# EasyEDA Pro project Charger Splitter.eprj, board PCB1
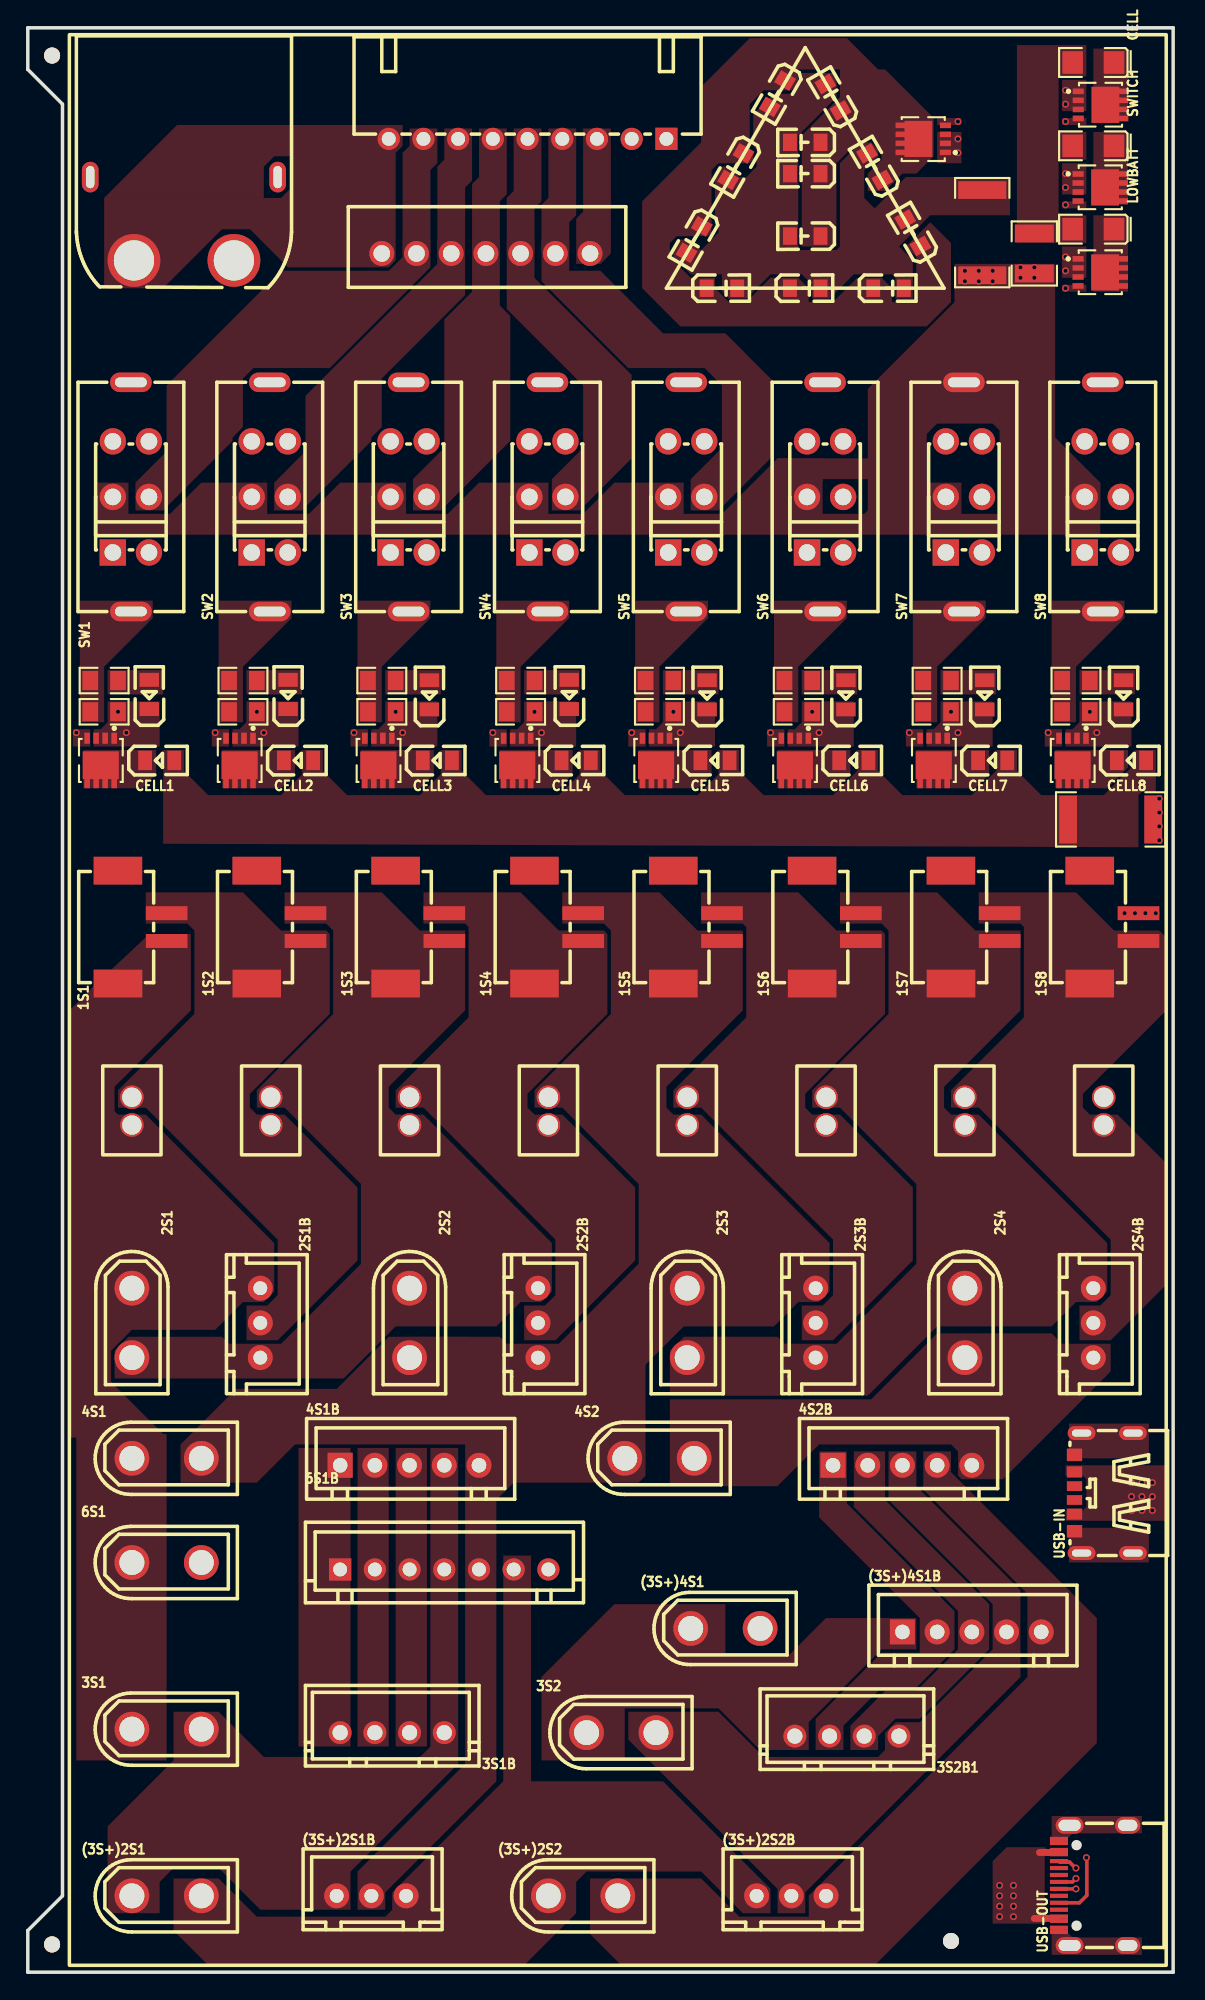
[diagram p5: board, top side]
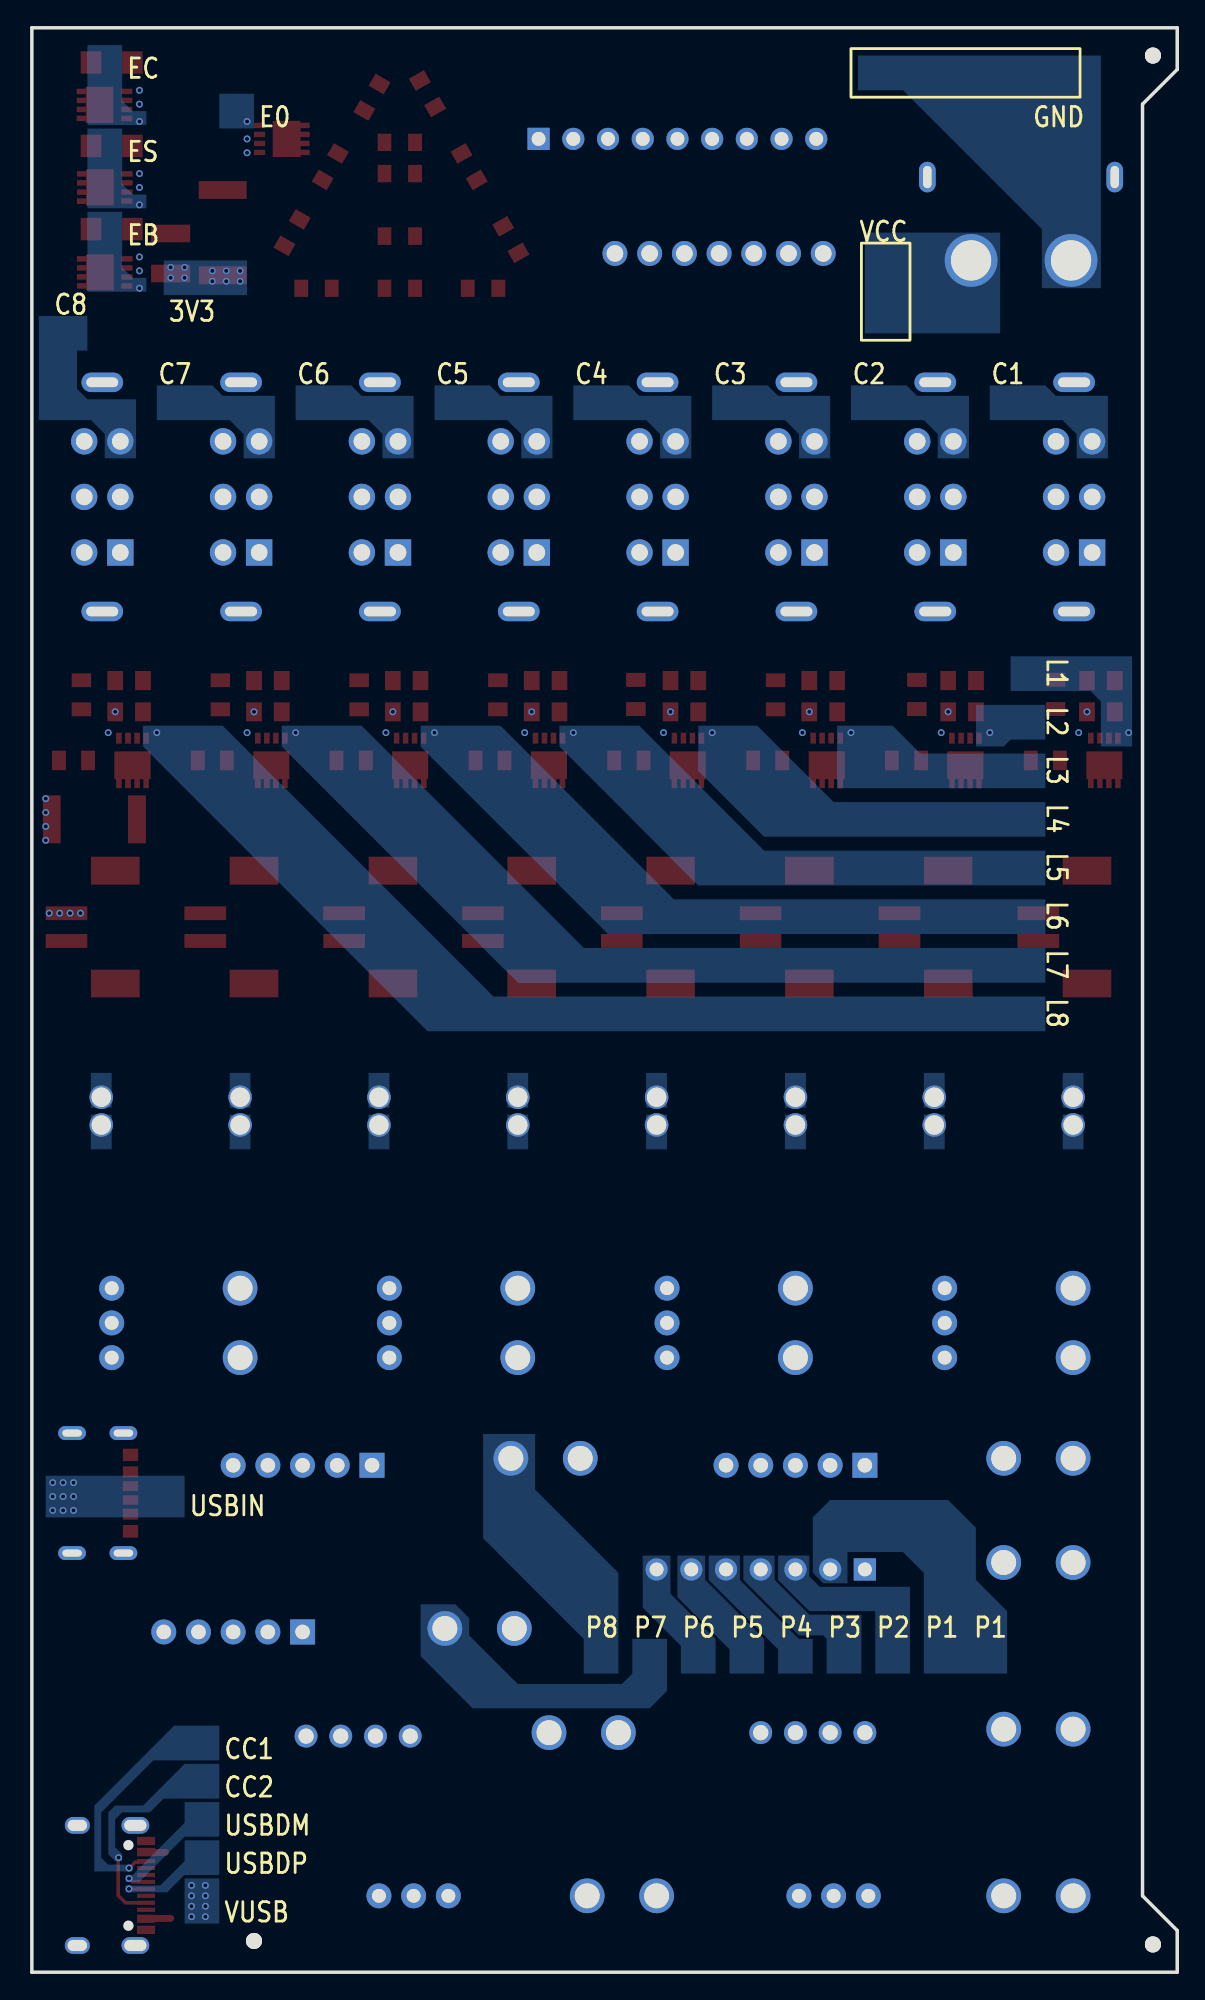
[diagram p6: board, bottom side, seen from below]

Outline 82.5 x 140 mm; copper layers: Top Layer, Inner1, Inner2, Inner3, Inner4, Bottom Layer. Coordinates in mm from the lower left corner of the outline.
Outline path: 0,140 82.5,140 82.5,0 0,0 0,3 2.5,5.5 2.5,134.5 0,137 0,140
Stack: Top Layer 0.035mm Outer layer thickness 1oz / Dielectric1 0.0994mm 3313 RC57% 4.2mil / Inner1 0.0152mm Inner layer thickness / Dielectric2 0.55mm 0.55mm H/H No copper / Inner2 0.0152mm Inner layer thickness / Dielectric3 0.1088mm 2116 RC54% 4.9mil / Inner3 0.0152mm Inner layer thickness / Dielectric4 0.55mm 0.55mm H/H No copper / Inner4 0.0152mm Inner layer thickness / Dielectric5 0.0994mm 3313 RC57% 4.2mil / Bottom Layer 0.035mm Outer layer thickness 1oz

## Design rules (mm)
template: JLCPCB Capability(Two Layers Board)
spacing copperThickness1oz (default): track to track 0.102, other pairs 0.152 to 0.3
spacing copperThickness2oz: track to track 0.203, other pairs 0.152 to 0.3
track width copperThickness1oz (default): min 0.127, default 0.254, max 2.54
track width copperThickness2oz: min 0.203, default 0.254, max 2.54
differential pair differentialPair (default): width min 0.127, default 0.254, max 2.54; gap min 0.152, default 0.152
via viaSize (default): diameter min 0.5, default 0.61, max 10; hole min 0.3, default 0.305, max 6.3

## Placement (name value [footprint] x y rotation side)
1S1  PH2.0-2P-LT  [CONN-SMD_PH2.0-1X2PW]  8.25 75.25 90 top
1S2  PH2.0-2P-LT  [CONN-SMD_PH2.0-1X2PW]  18.25 75.25 90 top
1S3  PH2.0-2P-LT  [CONN-SMD_PH2.0-1X2PW]  28.25 75.25 90 top
1S4  PH2.0-2P-LT  [CONN-SMD_PH2.0-1X2PW]  38.25 75.25 90 top
1S5  PH2.0-2P-LT  [CONN-SMD_PH2.0-1X2PW]  48.25 75.25 90 top
1S6  PH2.0-2P-LT  [CONN-SMD_PH2.0-1X2PW]  58.25 75.25 90 top
1S7  PH2.0-2P-LT  [CONN-SMD_PH2.0-1X2PW]  68.25 75.25 90 top
1S8  PH2.0-2P-LT  [CONN-SMD_PH2.0-1X2PW]  78.25 75.25 90 top
2S1  XT30UPB-M  [CONN-TH_XT30UPB-M]  7.5 46.75 270 top
2S1B  XH-3A  [CONN-TH_XH-3A]  16.75 46.75 270 top
2S2  XT30UPB-M  [CONN-TH_XT30UPB-M]  27.5 46.75 270 top
2S2B  XH-3A  [CONN-TH_XH-3A]  36.75 46.75 270 top
2S3  XT30UPB-M  [CONN-TH_XT30UPB-M]  47.5 46.75 270 top
2S3B  XH-3A  [CONN-TH_XH-3A]  56.75 46.75 270 top
2S4  XT30UPB-M  [CONN-TH_XT30UPB-M]  67.5 46.75 270 top
2S4B  XH-3A  [CONN-TH_XH-3A]  76.75 46.75 270 top
3S1  XT30UPB-M  [CONN-TH_XT30UPB-M]  10 17.5 0 top
3S1B  XH-4A  [CONN-TH_XH2.50-4P]  26.25 17.25 180 top
3S2  XT30UPB-M  [CONN-TH_XT30UPB-M]  42.75 17.25 0 top
3S2B1  XH-4A  [CONN-TH_XH2.50-4P]  59 17 180 top
4S1  XT30UPB-M  [CONN-TH_XT30UPB-M]  10 37 0 top
4S1B  XH-5A  [CONN-TH_5P-P2.50_XH-5A]  27.5 36.5 0 top
4S2  XT30UPB-M  [CONN-TH_XT30UPB-M]  45.5 37 0 top
4S2B  XH-5A  [CONN-TH_5P-P2.50_XH-5A]  63 36.5 0 top
6S1  XT30UPB-M  [CONN-TH_XT30UPB-M]  10 29.5 0 top
6S1B  XH-7A  [CONN-TH_7P-P2.50_HCTL_XH-7A]  30 29 0 top
(3S+)2S1  XT30UPB-M  [CONN-TH_XT30UPB-M]  10 5.5 0 top
(3S+)2S1B  XH-3A  [CONN-TH_XH-3A]  24.75 5.5 0 top
(3S+)2S2  XT30UPB-M  [CONN-TH_XT30UPB-M]  40 5.5 0 top
(3S+)2S2B  XH-3A  [CONN-TH_XH-3A]  55 5.5 0 top
(3S+)4S1  XT30UPB-M  [CONN-TH_XT30UPB-M]  50.25 24.75 0 top
(3S+)4S1B  XH-5A  [CONN-TH_5P-P2.50_XH-5A]  68 24.5 0 top
CELL  KT-1206W  [LED1206-R-RD_WHITE]  76.75 137.5 180 top
CELL1  NCD0805R1  [LED0805-R-RD]  9.5 87.25 0 top
CELL2  NCD0805R1  [LED0805-R-RD]  19.5 87.25 0 top
CELL3  NCD0805R1  [LED0805-R-RD]  29.5 87.25 0 top
CELL4  NCD0805R1  [LED0805-R-RD]  39.5 87.25 0 top
CELL5  NCD0805R1  [LED0805-R-RD]  49.5 87.25 0 top
CELL6  NCD0805R1  [LED0805-R-RD]  59.5 87.25 0 top
CELL7  NCD0805R1  [LED0805-R-RD]  69.5 87.25 0 top
CELL8  NCD0805R1  [LED0805-R-RD]  79.5 87.25 0 top
CELLLEDQ1  AGM6014AP  [PDFN-8_L3.1-W3.0-P0.65-LS3.3-BL]  5.25 87.25 180 top
CELLLEDQ2  AGM6014AP  [PDFN-8_L3.1-W3.0-P0.65-LS3.3-BL]  15.25 87.25 180 top
CELLLEDQ3  AGM6014AP  [PDFN-8_L3.1-W3.0-P0.65-LS3.3-BL]  25.25 87.25 180 top
CELLLEDQ4  AGM6014AP  [PDFN-8_L3.1-W3.0-P0.65-LS3.3-BL]  35.25 87.25 180 top
CELLLEDQ5  AGM6014AP  [PDFN-8_L3.1-W3.0-P0.65-LS3.3-BL]  45.25 87.25 180 top
CELLLEDQ6  AGM6014AP  [PDFN-8_L3.1-W3.0-P0.65-LS3.3-BL]  55.25 87.25 180 top
CELLLEDQ7  AGM6014AP  [PDFN-8_L3.1-W3.0-P0.65-LS3.3-BL]  65.25 87.25 180 top
CELLLEDQ8  AGM6014AP  [PDFN-8_L3.1-W3.0-P0.65-LS3.3-BL]  75.25 87.25 180 top
CELLLEDR1  68Ω  [R2512]  78 83 0 top
CN9  XH-9AW  [CONN-TH_9P-P2.50_XH-9AW]  36 132 180 top
CN10  XT60PW-M  [CONN-TH_XT60PW-M]  11.25 126.25 270 top
ERRORLEDARR1  XL-2012UPC  [LED0805-RD_PINK]  54 135.25 240 top
ERRORLEDARR2  XL-2012UPC  [LED0805-RD_PINK]  61 130 120 top
ERRORLEDARR3  XL-2012UPC  [LED0805-RD_PINK]  63.75 125.25 120 top
ERRORLEDARR4  XL-2012UPC  [LED0805-RD_PINK]  50 121.25 0 top
ERRORLEDARR5  XL-2012UPC  [LED0805-RD_PINK]  51 130 240 top
ERRORLEDARR6  XL-2012UPC  [LED0805-RD_PINK]  48 124.75 240 top
ERRORLEDARR7  XL-2012UPC  [LED0805-RD_PINK]  58 135 120 top
ERRORLEDARR8  XL-2012UPC  [LED0805-RD_PINK]  62 121.25 0 top
ERRORLEDARR9  XL-2012UPC  [LED0805-RD_PINK]  56 125 180 top
ERRORLEDARR10  XL-2012UPC  [LED0805-RD_PINK]  56 131.75 180 top
ERRORLEDARR11  XL-2012UPC  [LED0805-RD_PINK]  56 129.5 180 top
ERRORLEDARR12  XL-2012UPC  [LED0805-RD_PINK]  56 121.25 0 top
ERRORLEDARRQ1  AGM6014AP  [PDFN-8_L3.1-W3.0-P0.65-LS3.3-BL]  64.5 132 90 top
ERRORLEDARRR1  30Ω  [R2512]  68.75 125.25 90 top
ERRORLEDQ1  AGM6014AP  [PDFN-8_L3.1-W3.0-P0.65-LS3.3-BL]  77.27 134.45 270 top
ERRORLEDQ2  AGM6014AP  [PDFN-8_L3.1-W3.0-P0.65-LS3.3-BL]  77.25 128.5 270 top
ERRORLEDQ3  AGM6014AP  [PDFN-8_L3.1-W3.0-P0.65-LS3.3-BL]  77.25 122.38 270 top
ERRORLEDR3  20Ω  [R1210]  72.5 123.75 90 top
LOWBATT  KT-1206W  [LED1206-R-RD_WHITE]  76.75 125.5 180 top
NOREF  -  [Pad_e17]  37.5 61 0 top
NOREF#2  -  [Pad_e28]  77.5 63 0 top
NOREF#3  -  [Pad_e13]  27.5 63 0 top
NOREF#4  -  [Pad_e20]  47.5 61 0 top
NOREF#5  -  [Pad_e324]  1.75 138 0 top
NOREF#6  -  [Pad_e14]  27.5 61 0 top
NOREF#7  -  [Pad_e26]  67.5 61 0 top
NOREF#8  -  [Pad_e19]  47.5 63 0 top
NOREF#9  -  [Pad_e7]  7.5 61 0 top
NOREF#10  -  [Pad_e11]  17.5 61 0 top
NOREF#11  -  [Pad_e222]  66.5 2.25 0 top
NOREF#12  -  [Pad_e22]  57.5 63 0 top
NOREF#13  -  [Pad_e2]  7.5 63 0 top
NOREF#14  -  [Pad_e23]  57.5 61 0 top
NOREF#15  -  [Pad_e25]  67.5 63 0 top
NOREF#16  -  [Pad_e16]  37.5 63 0 top
NOREF#17  -  [Pad_e10]  17.5 63 0 top
NOREF#18  -  [Pad_e29]  77.5 61 0 top
NOREF#19  -  [Pad_e287]  1.75 2 0 top
P2  XH-7A  [CONN-TH_7P_XH-7A]  33 123.75 0 top
SW1  SS-22F07-G100  [SW-TH_6P-L16.5-W7.5-P4.0-LS2.6-TL]  7.43 106.22 90 top
SW1LED1  NCD0805Y1  [LED0805-R-RD]  8.75 92 90 top
SW1R1  3kΩ  [R0805]  5.5 90.75 0 top
SW1R2  68Ω  [R0805]  5.5 93 0 top
SW2  SS-22F07-G100  [SW-TH_6P-L16.5-W7.5-P4.0-LS2.6-TL]  17.43 106.22 90 top
SW2LED1  NCD0805Y1  [LED0805-R-RD]  18.75 92 90 top
SW2R1  3kΩ  [R0805]  15.5 90.75 0 top
SW2R2  68Ω  [R0805]  15.5 93 0 top
SW3  SS-22F07-G100  [SW-TH_6P-L16.5-W7.5-P4.0-LS2.6-TL]  27.43 106.22 90 top
SW3LED1  NCD0805Y1  [LED0805-R-RD]  28.93 91.97 90 top
SW3R1  3kΩ  [R0805]  25.5 90.75 0 top
SW3R2  68Ω  [R0805]  25.5 93 0 top
SW4  SS-22F07-G100  [SW-TH_6P-L16.5-W7.5-P4.0-LS2.6-TL]  37.43 106.22 90 top
SW4LED1  NCD0805Y1  [LED0805-R-RD]  39 92 90 top
SW4R1  3kΩ  [R0805]  35.5 90.75 0 top
SW4R2  68Ω  [R0805]  35.5 93 0 top
SW5  SS-22F07-G100  [SW-TH_6P-L16.5-W7.5-P4.0-LS2.6-TL]  47.43 106.22 90 top
SW5LED1  NCD0805Y1  [LED0805-R-RD]  48.93 91.97 90 top
SW5R1  3kΩ  [R0805]  45.5 90.75 0 top
SW5R2  68Ω  [R0805]  45.5 93 0 top
SW6  SS-22F07-G100  [SW-TH_6P-L16.5-W7.5-P4.0-LS2.6-TL]  57.43 106.22 90 top
SW6LED1  NCD0805Y1  [LED0805-R-RD]  58.93 91.97 90 top
SW6R1  3kΩ  [R0805]  55.5 90.75 0 top
SW6R2  68Ω  [R0805]  55.5 93 0 top
SW7  SS-22F07-G100  [SW-TH_6P-L16.5-W7.5-P4.0-LS2.6-TL]  67.43 106.22 90 top
SW7LED1  NCD0805Y1  [LED0805-R-RD]  68.93 91.97 90 top
SW7R1  3kΩ  [R0805]  65.5 90.75 0 top
SW7R2  68Ω  [R0805]  65.5 93 0 top
SW8  SS-22F07-G100  [SW-TH_6P-L16.5-W7.5-P4.0-LS2.6-TL]  77.43 106.22 90 top
SW8LED1  NCD0805Y1  [LED0805-R-RD]  78.93 91.97 90 top
SW8R1  3kΩ  [R0805]  75.5 90.75 0 top
SW8R2  68Ω  [R0805]  75.5 93 0 top
SWITCH  KT-1206W  [LED1206-R-RD_WHITE]  76.75 131.5 180 top
USB-IN  KH-TYPE-C-6P  [TYPE-C-SMD_TYPE-C-31-M-16]  77.5 34.5 90 top
USB-OUT  TYPE-C-31-M-12  [USB-C_SMD-TYPE-C-31-M-12]  76.75 6.25 90 top

## Footprints (pads in the part's own frame, mm; a bottom-side part is the same pattern mirrored in y, then rotated)
CONN-SMD_PH2.0-1X2PW
  rect 1x3 smd: 1(-1,-1.756) 2(1,-1.756)
  rect 2x3.5 smd: 3(4.064,1.756) 4(-4.064,1.756)
CONN-TH_5P-P2.50_XH-5A
  rect 1.8x1.8 hole 1.05: 1(-5,0)
  round 1.8 hole 1.05: 2(-2.498,0) 3(0.002,0) 4(2.501,0) 5(5,0)
CONN-TH_7P-P2.50_HCTL_XH-7A
  rect 1.6x1.6 hole 1: 1(-7.5,0)
  round 1.6 hole 1: 2(-5,0) 3(-2.5,0) 4(0,0) 5(2.5,0) 6(5,0) 7(7.5,0)
CONN-TH_7P_XH-7A
  round 1.8 hole 1.199: 1(-7.5,0) 2(-4.998,0) 3(-2.499,0) 4(0,0) 5(2.499,0) 6(5.002,0) 7(7.5,0)
CONN-TH_9P-P2.50_XH-9AW
  rect 1.6x1.6 hole 1: 1(-10,0)
  round 1.6 hole 1: 2(-7.5,0) 3(-5,0) 4(-2.5,0) 5(0,0) 6(2.5,0) 7(5,0) 8(7.5,0) 9(10,0)
CONN-TH_XH2.50-4P
  round 1.65 hole 1.1: 1(-3.75,0) 2(-1.25,0) 3(1.25,0) 4(3.75,0)
CONN-TH_XH-3A
  round 1.8 hole 1: 1(-2.5,0) 2(0,0) 3(2.5,0)
CONN-TH_XT30UPB-M
  round 2.5 hole 1.8: 1(-2.5,0) 2(2.5,0)
CONN-TH_XT60PW-M
  round 3.8 hole 2.9: 1(3,-3.6) 2(3,3.6)
  oval 2.2x1.2 hole 1.6x0.6: 3(-3,6.75) 4(-3,-6.75)
LED0805-R-RD
  rect 1x1.399 smd: 1(1.05,0) 2(-1.05,0)
LED0805-RD_PINK
  rect 1x1.25 smd: 1(-1.1,0) 2(1.1,0)
LED1206-R-RD_WHITE
  rect 1.485x1.62 smd: 1(1.492,0) 2(-1.492,0)
Pad_e2
  round 1.7 hole 1.4: 1(0,0)
Pad_e7
  round 1.7 hole 1.4: 1(0,0)
Pad_e10
  round 1.7 hole 1.4: 1(0,0)
Pad_e11
  round 1.7 hole 1.4: 1(0,0)
Pad_e13
  round 1.7 hole 1.4: 1(0,0)
Pad_e14
  round 1.7 hole 1.4: 1(0,0)
Pad_e16
  round 1.7 hole 1.4: 1(0,0)
Pad_e17
  round 1.7 hole 1.4: 1(0,0)
Pad_e19
  round 1.7 hole 1.4: 1(0,0)
Pad_e20
  round 1.7 hole 1.4: 1(0,0)
Pad_e22
  round 1.7 hole 1.4: 1(0,0)
Pad_e23
  round 1.7 hole 1.4: 1(0,0)
Pad_e25
  round 1.7 hole 1.4: 1(0,0)
Pad_e26
  round 1.7 hole 1.4: 1(0,0)
Pad_e28
  round 1.7 hole 1.4: 1(0,0)
Pad_e29
  round 1.7 hole 1.4: 1(0,0)
Pad_e222
  round 1.152 hole 1.152: 1(0,0)
Pad_e287
  round 1.152 hole 1.152: 1(0,0)
Pad_e324
  round 1.152 hole 1.152: 1(0,0)
PDFN-8_L3.1-W3.0-P0.65-LS3.3-BL
  rect 0.4x0.8 smd: 1(-0.975,-1.6) 2(-0.325,-1.6) 3(0.325,-1.6) 4(0.975,-1.6) 5(0.975,1.6) 6(0.325,1.6) 7(-0.325,1.6) 8(-0.975,1.6)
  rect 2.6x2 smd: 9(-0.004,0.35)
R0805
  rect 1.133x1.377 smd: 1(-1,0) 2(1,0)
R1210
  rect 1.282x2.808 smd: 1(-1.441,0) 2(1.441,0)
R2512
  rect 1.282x3.456 smd: 1(-3.067,0) 2(3.067,0)
SW-TH_6P-L16.5-W7.5-P4.0-LS2.6-TL
  rect 1.9x1.9 hole 1.2: 1(-4,1.3)
  round 1.9 hole 1.2: 2(0,1.3) 3(4,1.3) 4(-4,-1.3) 5(0,-1.3) 6(4,-1.3)
  oval 1.4x3 hole 0.7x2.3: 7(-8.25,0) 8(8.25,0)
TYPE-C-SMD_TYPE-C-31-M-16
  oval 1x2 hole 0.5x1.4: 1(-4.32,1.595) 2(4.32,1.595) 3(-4.32,-2.105) 4(4.32,-2.105)
  rect 0.7x1.1 smd: A5(-0.5,2.105) B5(0.5,2.105)
  rect 0.8x1.1 smd: A9(1.52,2.105) B9(-1.52,2.105)
  rect 0.9x1.1 smd: A12(2.75,2.105) B12(-2.75,2.105)
USB-C_SMD-TYPE-C-31-M-12
  oval 1.2x2 hole 0.8x1.6: 0(-4.325,1.706) 1(4.325,1.706)
  oval 1.2x1.8 hole 0.8x1.4: 2(4.325,-2.474) 3(-4.325,-2.474)
  rect 0.3x1.3 smd: A1(-3.35,2.474) A4(-2.55,2.474) A5(-1.25,2.474) A6(-0.25,2.474) A7(0.25,2.474) A8(1.25,2.474) A9(2.55,2.474) A12(3.35,2.474) B1(3.05,2.474) B4(2.25,2.474) B5(1.75,2.474) B6(0.75,2.474) B7(-0.75,2.474) B8(-1.75,2.474) B9(-2.25,2.474) B12(-3.05,2.474)

## Nets
3V3: CELLLEDR1.2 ERRORLEDARRR1.1 ERRORLEDR3.1 SW1.2 SW2.2 SW3.2 SW4.2 SW5.2 SW6.2 SW7.2 SW7.8 SW8.2
GND: 1S1.1 1S1.4 2S1.1 2S1B.1 3S1.1 3S1B.4 4S1.1 4S1B.1 6S1.1 6S1B.1 CELLLEDQ1.1 CELLLEDQ1.2 CELLLEDQ1.3 CELLLEDQ2.1 CELLLEDQ2.2 CELLLEDQ2.3 CELLLEDQ3.1 CELLLEDQ3.2 CELLLEDQ3.3 CELLLEDQ4.1 CELLLEDQ4.2 CELLLEDQ4.3 CELLLEDQ5.1 CELLLEDQ5.2 CELLLEDQ5.3 CELLLEDQ6.1 CELLLEDQ6.2 CELLLEDQ6.3 CELLLEDQ7.1 CELLLEDQ7.2 CELLLEDQ7.3 CELLLEDQ8.1 CELLLEDQ8.2 CELLLEDQ8.3 CN9.9 CN10.1 ERRORLEDARRQ1.1 ERRORLEDARRQ1.2 ERRORLEDARRQ1.3 ERRORLEDQ1.1 ERRORLEDQ1.2 ERRORLEDQ1.3 ERRORLEDQ2.1 ERRORLEDQ2.2 ERRORLEDQ2.3 ERRORLEDQ3.1 ERRORLEDQ3.2 ERRORLEDQ3.3 NOREF#9.1 P2.1 SW1LED1.2 SW1R1.2 SW2LED1.2 SW2R1.2 SW3LED1.2 SW3R1.2 SW4LED1.2 SW4R1.2 SW5LED1.2 SW5R1.2 SW6LED1.2 SW6R1.2 SW7LED1.2 SW7R1.2 SW8LED1.2 SW8R1.2 USB-IN.1 USB-IN.2 USB-IN.3 USB-IN.4 USB-IN.A12 USB-IN.B12 USB-OUT.0 USB-OUT.1 USB-OUT.2 USB-OUT.3 USB-OUT.A1 USB-OUT.A12 USB-OUT.B1 USB-OUT.B12
VCC: CN10.2 SW1.6 SW2.6 SW3.6 SW4.6 SW5.6 SW6.6 SW7.6 SW8.6
C1: SW1.3 SW1.7 SW1R1.1 SW1R2.1
C2: SW2.3 SW2.7 SW2R1.1 SW2R2.1
C3: SW3.3 SW3.7 SW3R1.1 SW3R2.1
C4: SW4.3 SW4.7 SW4R1.1 SW4R2.1
C5: SW5.3 SW5.7 SW5R1.1 SW5R2.1
C6: SW6.3 SW6.7 SW6R1.1 SW6R2.1
C7: SW7.3 SW7.7 SW7R1.1 SW7R2.1
C8: SW8.3 SW8.7 SW8R1.1 SW8R2.1
CC1: USB-OUT.A5
CC2: USB-OUT.B5
DM: USB-OUT.A7
DP: USB-OUT.A6
LEDERROR: ERRORLEDARRQ1.4
LEDERROR1: ERRORLEDQ1.4
LEDERROR2: ERRORLEDQ2.4
LEDERROR3: ERRORLEDQ3.4
LEDMOS1: CELLLEDQ1.4
LEDMOS2: CELLLEDQ2.4
LEDMOS3: CELLLEDQ3.4
LEDMOS4: CELLLEDQ4.4
LEDMOS5: CELLLEDQ5.4
LEDMOS6: CELLLEDQ6.4
LEDMOS7: CELLLEDQ7.4
LEDMOS8: CELLLEDQ8.4
P1: 1S1.2 1S2.1 1S2.4 2S1B.2 3S1B.3 4S1B.2 6S1B.2 CN9.8 NOREF#10.1 NOREF#13.1 P2.2 SW1.5
P2: 1S2.2 1S3.1 1S3.4 2S1.2 2S1B.3 2S2.1 2S2B.1 3S1B.2 4S1B.3 6S1B.3 CN9.7 NOREF#6.1 NOREF#17.1 P2.3 SW2.5
P3: 1S3.2 1S4.1 1S4.4 2S2B.2 3S1.2 3S1B.1 3S2.1 3S2B1.4 4S1B.4 6S1B.4 (3S+)2S1.1 (3S+)2S1B.1 (3S+)4S1.1 (3S+)4S1B.1 CN9.6 NOREF.1 NOREF#3.1 P2.4 SW3.5
P4: 1S4.2 1S5.1 1S5.4 2S2.2 2S2B.3 2S3.1 2S3B.1 3S2B1.3 4S1.2 4S1B.5 4S2.1 4S2B.1 6S1B.5 (3S+)2S1B.2 (3S+)4S1B.2 CN9.5 NOREF#4.1 NOREF#16.1 P2.5 SW4.5
P5: 1S5.2 1S6.1 1S6.4 2S3B.2 3S2B1.2 4S2B.2 6S1B.6 (3S+)2S1.2 (3S+)2S1B.3 (3S+)2S2.1 (3S+)2S2B.1 (3S+)4S1B.3 CN9.4 NOREF#8.1 NOREF#14.1 P2.6 SW5.5
P6: 1S6.2 1S7.1 1S7.4 2S3.2 2S3B.3 2S4.1 2S4B.1 3S2.2 3S2B1.1 4S2B.3 6S1.2 6S1B.7 (3S+)2S2B.2 (3S+)4S1B.4 CN9.3 NOREF#7.1 NOREF#12.1 P2.7 SW6.5
P7: 1S7.2 1S8.1 1S8.4 2S4B.2 4S2B.4 (3S+)2S2.2 (3S+)2S2B.3 (3S+)4S1.2 (3S+)4S1B.5 CN9.2 NOREF#15.1 NOREF#18.1 SW7.5
P8: 1S8.2 2S4.2 2S4B.3 4S2.2 4S2B.5 CN9.1 NOREF#2.1 SW8.5
USBIN: USB-IN.A9 USB-IN.B9
VUSB: USB-OUT.A4 USB-OUT.A9 USB-OUT.B4 USB-OUT.B9
$2N10164: CELL1.1 CELL2.1 CELL3.1 CELL4.1 CELL5.1 CELL6.1 CELL7.1 CELL8.1 CELLLEDR1.1
$2N10265: CELL3.2 CELLLEDQ3.5 CELLLEDQ3.6 CELLLEDQ3.7 CELLLEDQ3.8 CELLLEDQ3.9
$2N10267: CELL4.2 CELLLEDQ4.5 CELLLEDQ4.6 CELLLEDQ4.7 CELLLEDQ4.8 CELLLEDQ4.9
$2N10269: CELL2.2 CELLLEDQ2.5 CELLLEDQ2.6 CELLLEDQ2.7 CELLLEDQ2.8 CELLLEDQ2.9
$2N10270: CELL1.2 CELLLEDQ1.5 CELLLEDQ1.6 CELLLEDQ1.7 CELLLEDQ1.8 CELLLEDQ1.9
$2N10283: CELL6.2 CELLLEDQ6.5 CELLLEDQ6.6 CELLLEDQ6.7 CELLLEDQ6.8 CELLLEDQ6.9
$2N10286: CELL5.2 CELLLEDQ5.5 CELLLEDQ5.6 CELLLEDQ5.7 CELLLEDQ5.8 CELLLEDQ5.9
$2N10294: CELL8.2 CELLLEDQ8.5 CELLLEDQ8.6 CELLLEDQ8.7 CELLLEDQ8.8 CELLLEDQ8.9
$2N10298: CELL7.2 CELLLEDQ7.5 CELLLEDQ7.6 CELLLEDQ7.7 CELLLEDQ7.8 CELLLEDQ7.9
$2N14911: ERRORLEDQ2.5 ERRORLEDQ2.6 ERRORLEDQ2.7 ERRORLEDQ2.8 ERRORLEDQ2.9 SWITCH.2
$2N14912: CELL.1 ERRORLEDR3.2 LOWBATT.1 SWITCH.1
$2N14915: ERRORLEDQ3.5 ERRORLEDQ3.6 ERRORLEDQ3.7 ERRORLEDQ3.8 ERRORLEDQ3.9 LOWBATT.2
$2N14918: CELL.2 ERRORLEDQ1.5 ERRORLEDQ1.6 ERRORLEDQ1.7 ERRORLEDQ1.8 ERRORLEDQ1.9
$2N14921: ERRORLEDARR1.2 ERRORLEDARR2.2 ERRORLEDARR3.2 ERRORLEDARR4.2 ERRORLEDARR5.2 ERRORLEDARR6.2 ERRORLEDARR7.2 ERRORLEDARR8.2 ERRORLEDARR9.2 ERRORLEDARR10.2 ERRORLEDARR11.2 ERRORLEDARR12.2 ERRORLEDARRR1.2
$2N14922: ERRORLEDARR1.1 ERRORLEDARR2.1 ERRORLEDARR3.1 ERRORLEDARR4.1 ERRORLEDARR5.1 ERRORLEDARR6.1 ERRORLEDARR7.1 ERRORLEDARR8.1 ERRORLEDARR9.1 ERRORLEDARR10.1 ERRORLEDARR11.1 ERRORLEDARR12.1 ERRORLEDARRQ1.5 ERRORLEDARRQ1.6 ERRORLEDARRQ1.7 ERRORLEDARRQ1.8 ERRORLEDARRQ1.9
$2N50043: SW1LED1.1 SW1R2.2
$2N54068: SW2LED1.1 SW2R2.2
$2N54232: SW3LED1.1 SW3R2.2
$2N54394: SW4LED1.1 SW4R2.2
$2N58407: SW5LED1.1 SW5R2.2
$2N62417: SW6LED1.1 SW6R2.2
$2N62582: SW7LED1.1 SW7R2.2
$2N62745: SW8LED1.1 SW8R2.2

Pads without a net: 1S1 3; 1S2 3; 1S3 3; 1S4 3; 1S5 3; 1S6 3; 1S7 3; 1S8 3; CN10 3 4; NOREF#5 1; NOREF#11 1; NOREF#19 1; SW1 1 4 8; SW2 1 4 8; SW3 1 4 8; SW4 1 4 8; SW5 1 4 8; SW6 1 4 8; SW7 1 4; SW8 1 4 8; USB-IN A5 B5; USB-OUT A8 B6 B7 B8

## Via types
v1: diameter 0.5, hole 0.3, Top Layer to Bottom Layer, 75 vias

## Routing (per net, layer and track width the routed paths; a pad name or vN(x,y) marks a point on that pad's centre or on a via; arc(x,y) is an arc through that point)
3V3:
  vias: v1(67.5,122.5) v1(67.5,121.75) v1(68.5,122.5) v1(68.5,121.75) v1(69.5,122.5) v1(69.5,121.75) v1(71.5,122.75) v1(71.5,122) v1(72.5,122.75) v1(72.5,122) v1(81.5,84.5) v1(81.5,83.5) v1(81.5,82.5) v1(81.5,81.5)
GND:
  vias: v1(6.5,90.75) v1(7.1,89.25) v1(16.5,90.75) v1(17,89.25) v1(26.5,90.75) v1(27,89.25) v1(36.5,90.75) v1(37,89.25) v1(46.5,90.75) v1(47,89.25) v1(56.5,90.75) v1(57,89.25) v1(66.5,90.75) v1(67,132) v1(67,131) v1(67,89.25) v1(74.75,135.5) v1(74.75,134.5) v1(74.75,129.5) v1(74.75,128.5) v1(74.75,123.5) v1(74.75,122.5) v1(76.5,90.75) v1(77,89.25)
CC1: length 5
  Top Layer w0.254: v1(76.25,8.25) 76.28,8.22 76.28,5.53 75.75,5 USB-OUT.A5
CC2: length 1.4
  Top Layer w0.254: USB-OUT.B5 74.35,7.93 75.04,7.93 75.47,7.5 v1(75.5,7.5)
DM: length 1.3
  Top Layer w0.25: USB-OUT.A7 75.25,6.5 v1(75.5,6.75)
DP: length 1.2
  Top Layer w0.25: USB-OUT.A6 v1(75.5,6)
LEDERROR:
  vias: v1(67,133.25)
LEDERROR1:
  vias: v1(74.75,133.25)
LEDERROR2:
  vias: v1(74.75,127.25)
LEDERROR3:
  vias: v1(74.75,121.25)
LEDMOS1:
  vias: v1(3.5,89.25)
LEDMOS2:
  vias: v1(13.5,89.25)
LEDMOS3:
  vias: v1(23.5,89.25)
LEDMOS4:
  vias: v1(33.5,89.25)
LEDMOS5:
  vias: v1(43.5,89.25)
LEDMOS6:
  vias: v1(53.5,89.25)
LEDMOS7:
  vias: v1(63.5,89.25)
LEDMOS8:
  vias: v1(73.5,89.25)
P8:
  vias: v1(79,76.25) v1(79.75,76.25) v1(80.5,76.25) v1(81.25,76.25)
USBIN:
  vias: v1(79.5,35.25) v1(79.5,34.25) v1(79.5,33.25) v1(80.25,35.25) v1(80.25,34.25) v1(80.25,33.25) v1(81,35.25) v1(81,34.25) v1(81,33.25)
VUSB: length 2.9
  Top Layer w0.5: 74.15,8.62 72.88,8.62 ; 72.5,3.87 74.1,3.87
  vias: v1(70,6.25) v1(70,5.5) v1(70,4.75) v1(70,4) v1(71,6.25) v1(71,5.5) v1(71,4.75) v1(71,4)

## Copper pours and planes (outline as drawn; the poured copper is in the pictures)
3V3 on Top Layer: 54,109 60.75,109 60.75,107.25 54,107.25
3V3 on Top Layer: 5,109 77.25,109 77.25,103.5 5,103.5
3V3 on Top Layer: 60.5,122.75 77.25,122.75 77.25,104.75 60.5,104.75
3V3 on Top Layer: 66.75,123 74,123 74,121.5 66.75,121.5
3V3 on Bottom Layer: 67,123.25 73,123.25 73,120.75 67,120.75
3V3 on Inner3: 67,123 82,123 82,81 67,81
3V3 on Inner4: 67,123 82,123 82,81 67,81
GND on Top Layer: 5.5,133 19.25,133 19.25,127.75 5.5,127.75
GND on Top Layer: 3,74.75 17.75,74.75 17.75,38.5 3,38.5
GND on Top Layer: 19.5,37.75 23.25,37.75 23.25,16.25 19.5,16.25
GND on Top Layer: 75,32 80.75,32 80.75,29.5 75,29.5
GND on Top Layer: 54.75,91.5 59.5,91.5 59.5,88.25 54.75,88.25
GND on Top Layer: 3.5,38.75 10,38.75 10,15.25 3.5,15.25
GND on Top Layer: 34.75,91.5 39.5,91.5 39.5,88.25 34.75,88.25
GND on Top Layer: 73.75,3.25 80.25,3.25 80.25,1.25 73.75,1.25
GND on Top Layer: 73.75,11.25 80.25,11.25 80.25,9.25 73.75,9.25
GND on Top Layer: 44.75,91.5 49.5,91.5 49.5,88.25 44.75,88.25
GND on Top Layer: 4.75,91.5 9.5,91.5 9.5,88.25 4.75,88.25
GND on Top Layer: 74.5,124.25 76.25,124.25 76.25,122 74.5,122
GND on Top Layer: 74.5,130.25 76.25,130.25 76.25,128 74.5,128
GND on Top Layer: 64.75,91.5 69.5,91.5 69.5,88.25 64.75,88.25
GND on Top Layer: 75,39.5 80.75,39.5 80.75,37 75,37
GND on Top Layer: 5.5,133 27,133 27,121.25 5.5,121.25
GND on Top Layer: 74.75,91.5 79.5,91.5 79.5,88.25 74.75,88.25
GND on Top Layer: 14.75,91.5 19.5,91.5 19.5,88.25 14.75,88.25
GND on Top Layer: 24.75,91.5 29.5,91.5 29.5,88.25 24.75,88.25
GND on Top Layer: 74.5,136.25 76.25,136.25 76.25,134 74.5,134
GND on Top Layer: 65.5,132.5 67.25,132.5 67.25,130.25 65.5,130.25
GND on Bottom Layer: 5.5,138 23,138 23,121.25 5.5,121.25
GND on Bottom Layer: 6.75,61.75 8.25,61.75 8.25,59.25 6.75,59.25
GND on Inner1: 3.5,61.75 23.5,61.75 23.5,15.25 3.5,15.25
GND on Inner2: 3.5,61.75 23.5,61.75 23.5,15.25 3.5,15.25
GND on Inner3: 16,74.75 26.25,74.75 26.25,50.75 16,50.75
GND on Inner3: 64.25,90 82,90 82,10 64.25,10
GND on Inner3: 13.5,120.75 34.75,120.75 34.75,115.5 13.5,115.5
GND on Inner3: 4.75,126 78.25,126 78.25,46.25 4.75,46.25
GND on Inner3: 5.5,139.5 75.25,139.5 75.25,122 5.5,122
GND on Inner3: 73.75,10.25 82,10.25 82,1 73.75,1
GND on Inner4: 64.25,90 82,90 82,10 64.25,10
GND on Inner4: 4.75,126 78.25,126 78.25,46.25 4.75,46.25
GND on Inner4: 5.5,139.5 75.25,139.5 75.25,122 5.5,122
GND on Inner4: 73.75,10.25 82,10.25 82,1 73.75,1
GND on Inner4: 16,74.75 26.25,74.75 26.25,50.75 16,50.75
GND on Inner4: 13.5,120.75 34.75,120.75 34.75,115.5 13.5,115.5
VCC on Bottom Layer: 12.75,125.25 22.5,125.25 22.5,118 12.75,118
VCC on Inner1: 27.25,122.5 43.75,122.5 43.75,109.25 27.25,109.25
VCC on Inner1: 12.75,125.5 23.5,125.5 23.5,109.25 12.75,109.25
VCC on Inner1: 63.25,120.75 73.75,120.75 73.75,109.25 63.25,109.25
VCC on Inner1: 43.25,122.5 63.75,122.5 63.75,109.25 43.25,109.25
VCC on Inner1: 73.5,120.75 82,120.75 82,109.25 73.5,109.25
VCC on Inner1: 7.75,125.5 17,125.5 17,109.25 7.75,109.25
VCC on Inner1: 37.25,122.5 53.75,122.5 53.75,109.25 37.25,109.25
VCC on Inner1: 12.75,125.5 33.5,125.5 33.5,109.25 12.75,109.25
VCC on Inner2: 27.25,122.5 43.75,122.5 43.75,109.25 27.25,109.25
VCC on Inner2: 12.75,125.5 23.5,125.5 23.5,109.25 12.75,109.25
VCC on Inner2: 7.75,125.5 17,125.5 17,109.25 7.75,109.25
VCC on Inner2: 12.75,125.5 33.5,125.5 33.5,109.25 12.75,109.25
VCC on Inner2: 43.25,122.5 63.75,122.5 63.75,109.25 43.25,109.25
VCC on Inner2: 63.25,120.75 73.75,120.75 73.75,109.25 63.25,109.25
VCC on Inner2: 73.5,120.75 82,120.75 82,109.25 73.5,109.25
VCC on Inner2: 37.25,122.5 53.75,122.5 53.75,109.25 37.25,109.25
C1 on Top Layer: 3.75,98.75 9,98.75 9,90 3.75,90
C1 on Bottom Layer: 5,114.25 13.5,114.25 13.5,109 5,109
C1 on Inner1: 3,111.25 9,111.25 9,97.25 3,97.25
C1 on Inner2: 3,111.25 9,111.25 9,97.25 3,97.25
C2 on Top Layer: 13.75,98.75 19,98.75 19,90 13.75,90
C2 on Bottom Layer: 15,114.25 23.5,114.25 23.5,109 15,109
C2 on Inner1: 13,111.25 19,111.25 19,97.25 13,97.25
C2 on Inner2: 13,111.25 19,111.25 19,97.25 13,97.25
C3 on Top Layer: 23.75,98.75 29,98.75 29,90 23.75,90
C3 on Bottom Layer: 25,114.25 33.5,114.25 33.5,109 25,109
C3 on Inner1: 23,111.25 29,111.25 29,97.25 23,97.25
C3 on Inner2: 23,111.25 29,111.25 29,97.25 23,97.25
C4 on Top Layer: 33.75,98.75 39,98.75 39,90 33.75,90
C4 on Bottom Layer: 35,114.25 43.5,114.25 43.5,109 35,109
C4 on Inner1: 33,111.25 39,111.25 39,97.25 33,97.25
C4 on Inner2: 33,111.25 39,111.25 39,97.25 33,97.25
C5 on Top Layer: 43.75,98.75 49,98.75 49,90 43.75,90
C5 on Bottom Layer: 45,114.25 53.5,114.25 53.5,109 45,109
C5 on Inner1: 43,111.25 49,111.25 49,97.25 43,97.25
C5 on Inner2: 43,111.25 49,111.25 49,97.25 43,97.25
C6 on Top Layer: 53.75,98.75 59,98.75 59,90 53.75,90
C6 on Bottom Layer: 55,114.25 63.5,114.25 63.5,109 55,109
C6 on Inner1: 53,111.25 59,111.25 59,97.25 53,97.25
C6 on Inner2: 53,111.25 59,111.25 59,97.25 53,97.25
C7 on Top Layer: 63.75,98.75 69,98.75 69,90 63.75,90
C7 on Bottom Layer: 65,114.25 73.5,114.25 73.5,109 65,109
C7 on Inner1: 63,111.25 69,111.25 69,97.25 63,97.25
C7 on Inner2: 63,111.25 69,111.25 69,97.25 63,97.25
C8 on Top Layer: 73.75,98.75 79,98.75 79,90 73.75,90
C8 on Bottom Layer: 75,119.25 82,119.25 82,109 75,109
C8 on Inner1: 73,111.25 79,111.25 79,97.25 73,97.25
C8 on Inner2: 73,111.25 79,111.25 79,97.25 73,97.25
CC1 on Bottom Layer: 69,15 77,15 77,8 69,8
CC2 on Bottom Layer: 69,17.75 78,17.75 78,7.25 69,7.25
DM on Bottom Layer: 69,12.25 75.75,12.25 75.75,6.5 69,6.5
DP on Bottom Layer: 69,9.5 75.75,9.5 75.75,5.75 69,5.75
LEDERROR on Bottom Layer: 66.5,135.25 69,135.25 69,132.75 66.5,132.75
LEDERROR1 on Bottom Layer: 74.25,138.75 78.5,138.75 78.5,133 74.25,133
LEDERROR2 on Bottom Layer: 74.25,132.75 78.5,132.75 78.5,127 74.25,127
LEDERROR3 on Bottom Layer: 74.25,126.75 78.5,126.75 78.5,121 74.25,121
LEDMOS1 on Top Layer: 3.25,89.5 4.5,89.5 4.5,88.25 3.25,88.25
LEDMOS1 on Bottom Layer: 3.25,94.75 12,94.75 12,88.25 3.25,88.25
LEDMOS2 on Top Layer: 13.25,89.5 14.5,89.5 14.5,88.25 13.25,88.25
LEDMOS2 on Bottom Layer: 9.5,91.25 14.5,91.25 14.5,88.25 9.5,88.25
LEDMOS3 on Top Layer: 23.25,89.5 24.5,89.5 24.5,88.25 23.25,88.25
LEDMOS3 on Bottom Layer: 9.5,89.75 24.5,89.75 24.5,85.25 9.5,85.25
LEDMOS4 on Top Layer: 33.25,89.5 34.5,89.5 34.5,88.25 33.25,88.25
LEDMOS4 on Bottom Layer: 9.5,89.75 34.5,89.75 34.5,81.75 9.5,81.75
LEDMOS5 on Top Layer: 43.25,89.5 44.5,89.5 44.5,88.25 43.25,88.25
LEDMOS5 on Bottom Layer: 9.5,89.75 44.5,89.75 44.5,78.25 9.5,78.25
LEDMOS6 on Top Layer: 53.25,89.5 54.5,89.5 54.5,88.25 53.25,88.25
LEDMOS6 on Bottom Layer: 9.5,89.75 54.5,89.75 54.5,74.75 9.5,74.75
LEDMOS7 on Top Layer: 63.25,89.5 64.5,89.5 64.5,88.25 63.25,88.25
LEDMOS7 on Bottom Layer: 9.5,89.75 64.5,89.75 64.5,71.25 9.5,71.25
LEDMOS8 on Top Layer: 73.25,89.5 74.5,89.5 74.5,88.25 73.25,88.25
LEDMOS8 on Bottom Layer: 9.5,89.75 74.5,89.75 74.5,67.75 9.5,67.75
P1 on Top Layer: 27,132.75 29.5,132.75 29.5,123.75 27,123.75
P1 on Top Layer: 23.75,37.75 26,37.75 26,16.25 23.75,16.25
P1 on Top Layer: 6.5,77.75 23.75,77.75 23.75,45.5 6.5,45.5
P1 on Top Layer: 7.75,124.75 29,124.75 29,105.25 7.75,105.25
P1 on Bottom Layer: 16.75,61.75 18.25,61.75 18.25,59.25 16.75,59.25
P1 on Bottom Layer: 6.75,64.75 8.25,64.75 8.25,62.25 6.75,62.25
P1 on Bottom Layer: 12.25,34 26.25,34 26.25,21.5 12.25,21.5
P1 on Inner1: 15.75,48 26,48 26,35.5 15.75,35.5
P1 on Inner1: 3.25,107.25 12.75,107.25 12.75,62.25 3.25,62.25
P1 on Inner2: 3.25,107.25 12.75,107.25 12.75,62.25 3.25,62.25
P1 on Inner2: 15.75,48 26,48 26,35.5 15.75,35.5
P2 on Top Layer: 6.25,51 37.75,51 37.75,42.75 6.25,42.75
P2 on Top Layer: 26.5,37.75 28.75,37.75 28.75,16.25 26.5,16.25
P2 on Top Layer: 17.75,124.75 31.5,124.75 31.5,105.25 17.75,105.25
P2 on Top Layer: 29.5,132.75 32,132.75 32,123.75 29.5,123.75
P2 on Top Layer: 16.5,77.75 37.75,77.75 37.75,50.75 16.5,50.75
P2 on Bottom Layer: 26.75,61.75 28.25,61.75 28.25,59.25 26.75,59.25
P2 on Bottom Layer: 16.75,64.75 18.25,64.75 18.25,62.25 16.75,62.25
P2 on Bottom Layer: 19.25,30 28.75,30 28.75,21.5 19.25,21.5
P2 on Inner1: 25.75,50.75 32.5,50.75 32.5,35.5 25.75,35.5
P2 on Inner1: 13.25,107.25 22.75,107.25 22.75,62.25 13.25,62.25
P2 on Inner2: 25.75,50.75 32.5,50.75 32.5,35.5 25.75,35.5
P2 on Inner2: 13.25,107.25 22.75,107.25 22.75,62.25 13.25,62.25
P3 on Top Layer: 32,132.75 34.5,132.75 34.5,123.75 32,123.75
P3 on Top Layer: 5.75,37.75 31,37.75 31,4.25 5.75,4.25
P3 on Top Layer: 27.75,124.75 34.75,124.75 34.75,105.25 27.75,105.25
P3 on Top Layer: 37,26.5 64,26.5 64,15.25 37,15.25
P3 on Top Layer: 26.5,77.75 43.75,77.75 43.75,45.5 26.5,45.5
P3 on Bottom Layer: 26.75,64.75 28.25,64.75 28.25,62.25 26.75,62.25
P3 on Bottom Layer: 36.75,61.75 38.25,61.75 38.25,59.25 36.75,59.25
P3 on Bottom Layer: 22.75,30 31.25,30 31.25,21.5 22.75,21.5
P3 on Inner1: 23.25,107.25 32.75,107.25 32.75,62.25 23.25,62.25
P3 on Inner1: 10.5,20.25 42,20.25 42,9.75 10.5,9.75
P3 on Inner1: 29,48 37.75,48 37.75,35.5 29,35.5
P3 on Inner2: 10.5,20.25 42,20.25 42,9.75 10.5,9.75
P3 on Inner2: 29,48 37.75,48 37.75,35.5 29,35.5
P3 on Inner2: 23.25,107.25 32.75,107.25 32.75,62.25 23.25,62.25
P3 on Inner3: 10,61.75 39.25,61.75 39.25,15.25 10,15.25
P3 on Inner4: 10,61.75 39.25,61.75 39.25,15.25 10,15.25
P4 on Top Layer: 34.5,132.75 37,132.75 37,123.75 34.5,123.75
P4 on Top Layer: 34.5,124.75 43.5,124.75 43.5,105.25 34.5,105.25
P4 on Top Layer: 11,45.75 31.75,45.75 31.75,35.25 11,35.25
P4 on Top Layer: 23.75,45.75 44.5,45.75 44.5,4.5 23.75,4.5
P4 on Top Layer: 26.25,51 57.75,51 57.75,42.75 26.25,42.75
P4 on Top Layer: 36.5,77.75 57.75,77.75 57.75,50.75 36.5,50.75
P4 on Top Layer: 56.75,37.5 66.75,37.5 66.75,16 56.75,16
P4 on Bottom Layer: 46.75,61.75 48.25,61.75 48.25,59.25 46.75,59.25
P4 on Bottom Layer: 36.75,64.75 38.25,64.75 38.25,62.25 36.75,62.25
P4 on Bottom Layer: 26.25,30 33.75,30 33.75,21.5 26.25,21.5
P4 on Inner1: 33.25,107.25 42.75,107.25 42.75,62.25 33.25,62.25
P4 on Inner2: 33.25,107.25 42.75,107.25 42.75,62.25 33.25,62.25
P4 on Inner3: 55.75,50.5 62.75,50.5 62.75,35.5 55.75,35.5
P4 on Inner4: 55.75,50.5 62.75,50.5 62.75,35.5 55.75,35.5
P5 on Top Layer: 34.25,30 36.25,30 36.25,13.5 34.25,13.5
P5 on Top Layer: 46.5,77.75 63.75,77.75 63.75,45.5 46.5,45.5
P5 on Top Layer: 10.5,13.75 53.5,13.75 53.5,0.5 10.5,0.5
P5 on Top Layer: 59.25,37.5 69.25,37.5 69.25,16 59.25,16
P5 on Top Layer: 37,132.75 39.5,132.75 39.5,123.75 37,123.75
P5 on Top Layer: 37,124.75 53.75,124.75 53.75,105.25 37,105.25
P5 on Bottom Layer: 46.75,64.75 48.25,64.75 48.25,62.25 46.75,62.25
P5 on Bottom Layer: 56.75,61.75 58.25,61.75 58.25,59.25 56.75,59.25
P5 on Bottom Layer: 29.75,30 36,30 36,21.5 29.75,21.5
P5 on Inner1: 43.25,107.25 52.75,107.25 52.75,62.25 43.25,62.25
P5 on Inner2: 43.25,107.25 52.75,107.25 52.75,62.25 43.25,62.25
P5 on Inner3: 10.5,61.75 61.75,61.75 61.75,3.5 10.5,3.5
P5 on Inner4: 10.5,61.75 61.75,61.75 61.75,3.5 10.5,3.5
P6 on Top Layer: 39.5,132.75 42,132.75 42,123 39.5,123
P6 on Top Layer: 43.25,37.5 71.5,37.5 71.5,4.25 43.25,4.25
P6 on Top Layer: 56.5,77.75 77.75,77.75 77.75,50.75 56.5,50.75
P6 on Top Layer: 46.25,51 77.75,51 77.75,41.5 46.25,41.5
P6 on Bottom Layer: 56.75,64.75 58.25,64.75 58.25,62.25 56.75,62.25
P6 on Bottom Layer: 66.75,61.75 68.25,61.75 68.25,59.25 66.75,59.25
P6 on Bottom Layer: 33.25,30 38.5,30 38.5,21.5 33.25,21.5
P6 on Inner1: 53.25,107.25 62.75,107.25 62.75,62.25 53.25,62.25
P6 on Inner1: 10.5,45.75 49.75,45.75 49.75,15.25 10.5,15.25
P6 on Inner2: 10.5,45.75 49.75,45.75 49.75,15.25 10.5,15.25
P6 on Inner2: 53.25,107.25 62.75,107.25 62.75,62.25 53.25,62.25
P6 on Inner3: 39.5,124.75 59.75,124.75 59.75,105.25 39.5,105.25
P6 on Inner4: 39.5,124.75 59.75,124.75 59.75,105.25 39.5,105.25
P7 on Top Layer: 40.5,37.5 77,37.5 77,0.5 40.5,0.5
P7 on Top Layer: 66.5,77.75 82,77.75 82,45.5 66.5,45.5
P7 on Bottom Layer: 66.75,64.75 68.25,64.75 68.25,62.25 66.75,62.25
P7 on Bottom Layer: 36.75,26.5 54.5,26.5 54.5,19 36.75,19
P7 on Bottom Layer: 76.75,61.75 78.25,61.75 78.25,59.25 76.75,59.25
P7 on Inner1: 40.5,61.75 79.25,61.75 79.25,0.5 40.5,0.5
P7 on Inner1: 63.25,107.25 72.75,107.25 72.75,62.25 63.25,62.25
P7 on Inner1: 69.5,30.25 74.25,30.25 74.25,25.75 69.5,25.75
P7 on Inner2: 69.5,30.25 74.25,30.25 74.25,25.75 69.5,25.75
P7 on Inner2: 63.25,107.25 72.75,107.25 72.75,62.25 63.25,62.25
P7 on Inner2: 40.5,61.75 79.25,61.75 79.25,0.5 40.5,0.5
P7 on Inner3: 42.25,133 70,133 70,105 42.25,105
P7 on Inner4: 42.25,133 70,133 70,105 42.25,105
P8 on Top Layer: 46.25,46 78,46 78,35 46.25,35
P8 on Bottom Layer: 40.25,38.75 50,38.75 50,21.5 40.25,21.5
P8 on Bottom Layer: 76.75,64.75 78.25,64.75 78.25,62.25 76.75,62.25
P8 on Inner1: 46.25,67 77.5,67 77.5,35 46.25,35
P8 on Inner1: 73.25,107.25 82,107.25 82,62.25 73.25,62.25
P8 on Inner2: 73.25,107.25 82,107.25 82,62.25 73.25,62.25
P8 on Inner2: 46.25,67 77.5,67 77.5,35 46.25,35
P8 on Inner3: 45,133 79.75,133 79.75,105.25 45,105.25
P8 on Inner4: 45,133 79.75,133 79.75,105.25 45,105.25
USBIN on Top Layer: 74.75,36.5 82,36.5 82,32.5 74.75,32.5
USBIN on Bottom Layer: 71.5,35.75 81.5,35.75 81.5,32.75 71.5,32.75
VUSB on Top Layer: 69.5,9 74.75,9 74.75,3.5 69.5,3.5
VUSB on Bottom Layer: 69,6.75 71.5,6.75 71.5,3.5 69,3.5
$2N10164 on Top Layer: 9.75,88 81.25,88 81.25,81 9.75,81
$2N10265 on Top Layer: 24,88 29.25,88 29.25,85.25 24,85.25
$2N10267 on Top Layer: 34,88 39.25,88 39.25,85.25 34,85.25
$2N10269 on Top Layer: 14,88 19.25,88 19.25,85.25 14,85.25
$2N10270 on Top Layer: 4,88 9.25,88 9.25,85.25 4,85.25
$2N10283 on Top Layer: 54,88 59.25,88 59.25,85.25 54,85.25
$2N10286 on Top Layer: 44,88 49.25,88 49.25,85.25 44,85.25
$2N10294 on Top Layer: 74,88 79.25,88 79.25,85.25 74,85.25
$2N10298 on Top Layer: 64,88 69.25,88 69.25,85.25 64,85.25
$2N14911 on Top Layer: 76.75,132.5 79.25,132.5 79.25,127.25 76.75,127.25
$2N14912 on Top Layer: 71.25,138.75 76.25,138.75 76.25,124.5 71.25,124.5
$2N14915 on Top Layer: 76.75,126.5 79.25,126.5 79.25,121 76.75,121
$2N14918 on Top Layer: 76.75,138.5 79.25,138.5 79.25,133.25 76.75,133.25
$2N14921 on Top Layer: 46.5,136.75 70.75,136.75 70.75,120.5 46.5,120.5
$2N14922 on Top Layer: 44.25,139.25 66.5,139.25 66.5,118.5 44.25,118.5
$2N50043 on Top Layer: 5.75,93.75 9.75,93.75 9.75,92 5.75,92
$2N54068 on Top Layer: 15.75,93.75 19.75,93.75 19.75,92 15.75,92
$2N54232 on Top Layer: 25.75,93.75 29.75,93.75 29.75,92 25.75,92
$2N54394 on Top Layer: 35.75,93.75 39.75,93.75 39.75,92 35.75,92
$2N58407 on Top Layer: 45.75,93.75 49.75,93.75 49.75,92 45.75,92
$2N62417 on Top Layer: 55.75,93.75 59.75,93.75 59.75,92 55.75,92
$2N62582 on Top Layer: 65.75,93.75 69.75,93.75 69.75,92 65.75,92
$2N62745 on Top Layer: 75.75,93.75 79.75,93.75 79.75,92 75.75,92

Small or netless copper shapes (teardrops, artwork), in the pictures only: 4 on Top Layer

## Text on the board
Bottom Silkscreen Layer: GND | C1 | P1 | P2 | VCC | C2 | P3 | P4 | P5 | C3 | P6 | P7 | P8 | C4 | C5 | C6 | E0 | CC1 | CC2 | USBDM | USBDP | VUSB | USBIN | 3V3 | C7 | EC | ES | EB | C8 | L2 | L3 | L4 | L5 | L6 | L7 | L8 | L1
